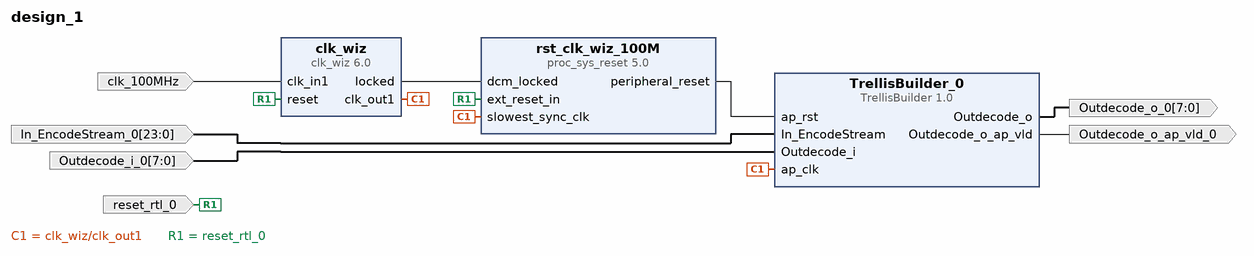
[diagram p0: block diagram of the top level]
# Vivado block design design_1, xc7vx485tffg1761-3, Vivado 2022.1
create_bd_design design_1

create_bd_port -dir I -type clk clk_100MHz
set_property -dict {CONFIG.FREQ_HZ 142800000} [get_bd_ports clk_100MHz]
create_bd_port -dir I -type rst reset_rtl_0
set_property -dict {CONFIG.POLARITY ACTIVE_HIGH} [get_bd_ports reset_rtl_0]
create_bd_port -dir I -from 23 -to 0 -type data In_EncodeStream_0
create_bd_port -dir I -from 7 -to 0 -type data Outdecode_i_0
create_bd_port -dir O -from 7 -to 0 -type data Outdecode_o_0
create_bd_port -dir O Outdecode_o_ap_vld_0

create_bd_cell -type ip -vlnv xilinx.com:hls:TrellisBuilder:1.0 TrellisBuilder_0
create_bd_cell -type ip -vlnv xilinx.com:ip:clk_wiz:6.0 clk_wiz
set_property -dict [list \
  CONFIG.CLKIN1_JITTER_PS 70.02 \
  CONFIG.CLKOUT1_JITTER 112.777 \
  CONFIG.CLKOUT1_PHASE_ERROR 94.837 \
  CONFIG.CLKOUT1_REQUESTED_OUT_FREQ 142.8 \
  CONFIG.MMCM_CLKFBOUT_MULT_F 7.000 \
  CONFIG.MMCM_CLKIN1_PERIOD 7.003 \
  CONFIG.MMCM_CLKOUT0_DIVIDE_F 7.000 \
  CONFIG.MMCM_DIVCLK_DIVIDE 1 \
  CONFIG.PRIM_IN_FREQ 142.8 \
] [get_bd_cells clk_wiz]
create_bd_cell -type ip -vlnv xilinx.com:ip:proc_sys_reset:5.0 rst_clk_wiz_100M

# ---- connections ----

connect_bd_net -net In_EncodeStream_0_1 [get_bd_ports In_EncodeStream_0] [get_bd_pins TrellisBuilder_0/In_EncodeStream]
connect_bd_net -net Outdecode_i_0_1 [get_bd_ports Outdecode_i_0] [get_bd_pins TrellisBuilder_0/Outdecode_i]
connect_bd_net [get_bd_pins TrellisBuilder_0/Outdecode_o] [get_bd_ports Outdecode_o_0]
connect_bd_net [get_bd_pins TrellisBuilder_0/Outdecode_o_ap_vld] [get_bd_ports Outdecode_o_ap_vld_0]
connect_bd_net [get_bd_ports clk_100MHz] [get_bd_pins clk_wiz/clk_in1]
connect_bd_net [get_bd_pins clk_wiz/clk_out1] [get_bd_pins TrellisBuilder_0/ap_clk] [get_bd_pins rst_clk_wiz_100M/slowest_sync_clk]
connect_bd_net [get_bd_pins clk_wiz/locked] [get_bd_pins rst_clk_wiz_100M/dcm_locked]
connect_bd_net -net reset_rtl_0_1 [get_bd_ports reset_rtl_0] [get_bd_pins clk_wiz/reset] [get_bd_pins rst_clk_wiz_100M/ext_reset_in]
connect_bd_net [get_bd_pins rst_clk_wiz_100M/peripheral_reset] [get_bd_pins TrellisBuilder_0/ap_rst]

validate_bd_design
save_bd_design
